# Altium schematic sheet power_amp.SchDoc
size A4; SheetNumber: 4; SheetTotal: 6
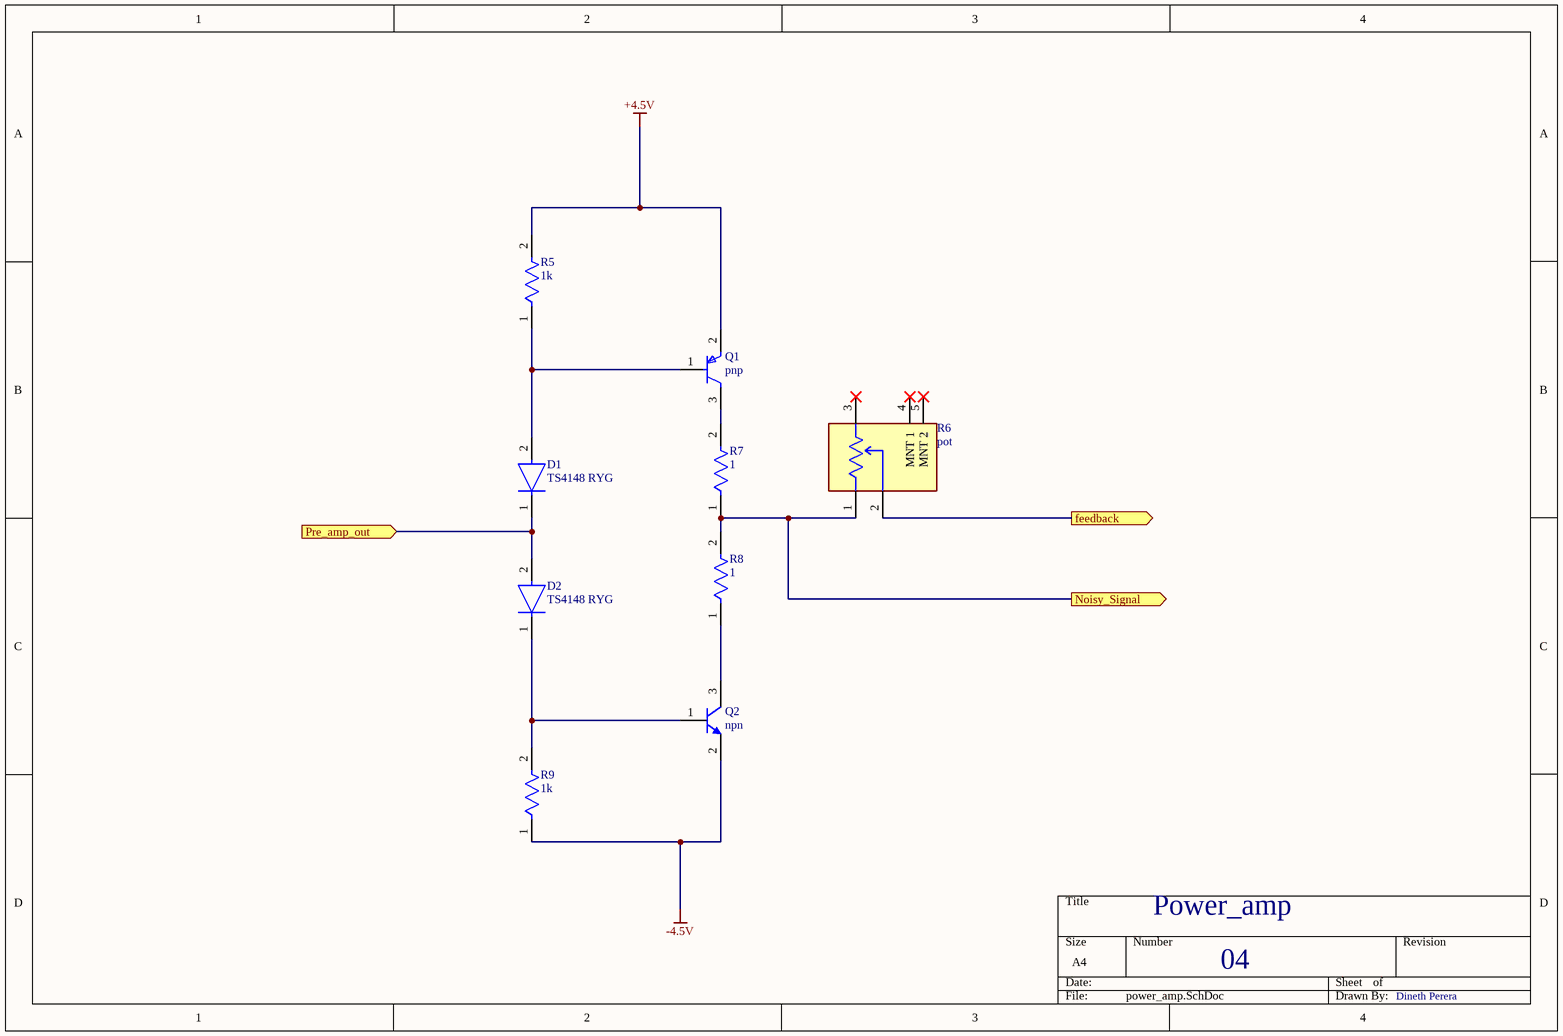
[diagram p0: power_amp.SchDoc]

## Parts
D1  TS4148 RYG  [FP-TS4148_RYG-MFG]
D2  TS4148 RYG  [FP-TS4148_RYG-MFG]
Q1  pnp  [FP-318BM-MFG]
Q2  npn  [INF-SOT23_L]
R5  1k  [FP-ERA6A-IPC_C]
R6  pot  [FP-PTV09A-4-MFG]
R7  1  [FP-CRCW0805-e3-MFG]
R8  1  [FP-CRCW0805-e3-MFG]
R9  1k  [FP-ERA6A-IPC_C]

## Ports
feedback (out), Noisy_Signal (out), Pre_amp_out (in)

## Nets
+4.5V: Q1.2(E) R5.2
-4.5V: Q2.2(E) R9.1
feedback: R6.2 ; port feedback
Noisy_Signal: R6.1 R7.1 R8.2 ; port Noisy_Signal
Pre_amp_out: D1.1(C) D2.2(A) ; port Pre_amp_out
NetD1_2: D1.2(A) Q1.1(B) R5.1
NetD2_1: D2.1(C) Q2.1(B) R9.2
NetQ1_3: Q1.3(C) R7.2
NetQ2_3: Q2.3(C) R8.1

Not connected (* = marked no-connect by the designer): R6 3* 4(MNT_1)* 5(MNT_2)*

## Notes on the sheet
- Power_amp
- 04
- Dineth Perera

## Library data of the parts
D1 D2 = CMP-15605-000006-1: Rectifier Diode Switching 75V 0.15A 4ns 2-Pin Case 0805(2012Metric) T/R; Peak Non-Repetitive Surge Current: 2A; Element Configuration: Single; Forward Voltage: 1V; Max Operating Temperature: 175°C; Packaging: Tape and Reel; Radiation Hardening: No; Min Operating Temperature: -65°C; Reverse Recovery Time: 4ns; Mount: Surface Mount; RoHS Compliant: Yes; Max Forward Surge Current (Ifsm): 2A; Case/Package: SMD/SMT; Number of Pins: 2; Max Repetitive Reverse Voltage (Vrrm): 75V
Q1 = CMP-00278-84330287-1: MMBTA56 Small Signal Bipolar Transistor, 0.5A I(C), 80V V(BR)CEO, 1-Element, PNP, Silicon; Manufacturer Lifecycle Status: OBSOLETE; Voltage Rating (DC): -80V; Current Rating: -500mA; Power Dissipation: 350mW; Collector Emitter Breakdown Voltage: 80V; Schedule B: 8541210080, 8541210080; RoHS: Compliant; Number of Pins: 3; NexarPartId: 84330287; Polarity: PNP; Packaging: Digi-Reel®; Lifecycle Status: Obsolete; Lead Free: Lead Free
Q2 = CMP-1177-00051-1: NPN Silicon AF Transistor, 80 V VCEO, 500 mA IC, SOT23, Reel, Green; PartNumber: SMBTA06; Manufacturer: Infineon; IC (max): 500Â mA; ICBO (max): 100Â nA; VCBO (max): 80Â V; Green: TRUE; fT (typ): 100Â MHz; VEBO (max): 4Â V; VCE: 1 V; ICM (max): 1,000Â mA; IC: 100Â mA; IBM (max): 200Â mA; Ptot (max): 330 mW; PackageVersion: Apr-08; ComponentLink3Description: Package Specification; Polarity: NPN; ComponentLink1URL: http://www.infineon.com/; Mounting Technology: Surface Mount; Packing: Reel; ComponentLink2Description: Datasheet; PackageReference: SOT23; ComponentLink3URL: http://www.infineon.com/dgdl/SOT23-Package_Overview.pdf?folderId=db3a30431936bc4b0119532290053c66&fileId=db3a30431936bc4b0119533468123c85; PackageDescription: 3-Pin Small Outline Transistor Package, 1.3 x 2.9 mm Body, 0.95 mm Pitch; VCEO (max): 80Â V; ComponentLink1Description: Manufacturer URL; ComponentLink2URL: http://www.infineon.com/dgdl/smbta06_mmbta06.pdf?folderId=db3a304314dca389011545f4eb561884&fileId=db3a304314dca3890115478ecca71a2d
R5 R9 = CMP-2001-00581-2: RES 1K OHM 0.1% 1/8W 0805; Temperature Coefficient: 25ppm/°C; Resistance: 1kR; Working Voltage: 100V; Max Power Dissipation: 125mW; Height: 0.5mm; Technology: THIN FILM; REACH SVHC: No SVHC; Packaging: Tape and Reel; Length: 2mm; Width: 1.25mm; Resistance Tolerance: 0.1%; Series: ERA-6A; Resistor Type: Thin Film; Number of Pins: 2; Case Code (Metric): 2012; Voltage Rating: 100V; Radiation Hardening: No; Construction: Rectangular; Mount: Surface Mount; Number of Terminations: 2; Case/Package: 0805; Min Operating Temperature: -55°C; Military Standard: Not; RoHS Compliant: Yes; Termination: SMD/SMT; Case Code (Imperial): 0805; Depth: 1.25mm; Power Rating: 125mW; Max Operating Temperature: 155°C; Contact Plating: Tin; Package Quantity: 5000; Tolerance: 0.1%
R6 = CMP-07234-000013-1: POT 10K OHM 1/20W CARBON LINEAR; Manufacturer Part Number: PTV09A-4020U-B103; Manufacturer: Bourns Inc.; Voltage Rating: 50V; Resistance: 10kΩ; Description: Res Carbon Film POT 10K Ohm 20% 1/20W 1(Elec)/1(Mech)Turn 6mm Pin Bracket Mount/Through Hole; Tolerance: 20%; Value: 10kΩ; Power Rating: 0.05W; Composition: Carbon; Lead Free: Yes; Device Class L1: Passive Components; Device Class L3: Variable Resistors and Potentiometers; Temperature: -10°C to +50°C; Series: PTV09; Device Class L2: Resistors; Temperature Range Low: -10°C; Height: 20.5mm; Temperature Range High: +50°C; Octopart: https://octopart.com/ptv09a-4020u-b103-bourns-1878033; Digikey Description: POT 10K OHM 1/20W CARBON LINEAR; RoHS: TRUE; ComponentLink2URL: https://www.bourns.com/docs/product-datasheets/ptv09.pdf?sfvrsn=5e1089f1_12; Package: PTV09A-4; Mouser Description: Potentiometers 10K LINEAR 20%; Category: Res; ComponentLink2Description: Datasheet; Automotive: No
R7 R8 = CMP-2001-03649-2: RES Thick Film, 1Ω, 1%, 0.125W, 100ppm/°C, 0805; Power Rating: 125mW; Resistance: 1R; Voltage Rating: 150V; Number of Terminations: 2; Mount: Surface Mount; Packaging: Tape and Reel; Radiation Hardening: No; Number of Pins: 2; Case Code (Imperial): 0805; Contact Plating: Tin; Military Standard: Not; Min Operating Temperature: -55°C; Case Code (Metric): 2012; Max Operating Temperature: 155°C; Max Power Dissipation: 125mW; Termination: SMD/SMT; Weight: 0.000194oz; Case/Package: 0805; Width: 0.049inch; Temperature Coefficient: 100ppm/°C; Package Quantity: 10; Composition: Thick Film; Tolerance: 1%; Height: 0.02inch; Depth: 1.25mm; Length: 2mm; Features: Automotive AEC-Q200